# EAGLE schematic testESP ver.1 (EAGLE 9.6.2)
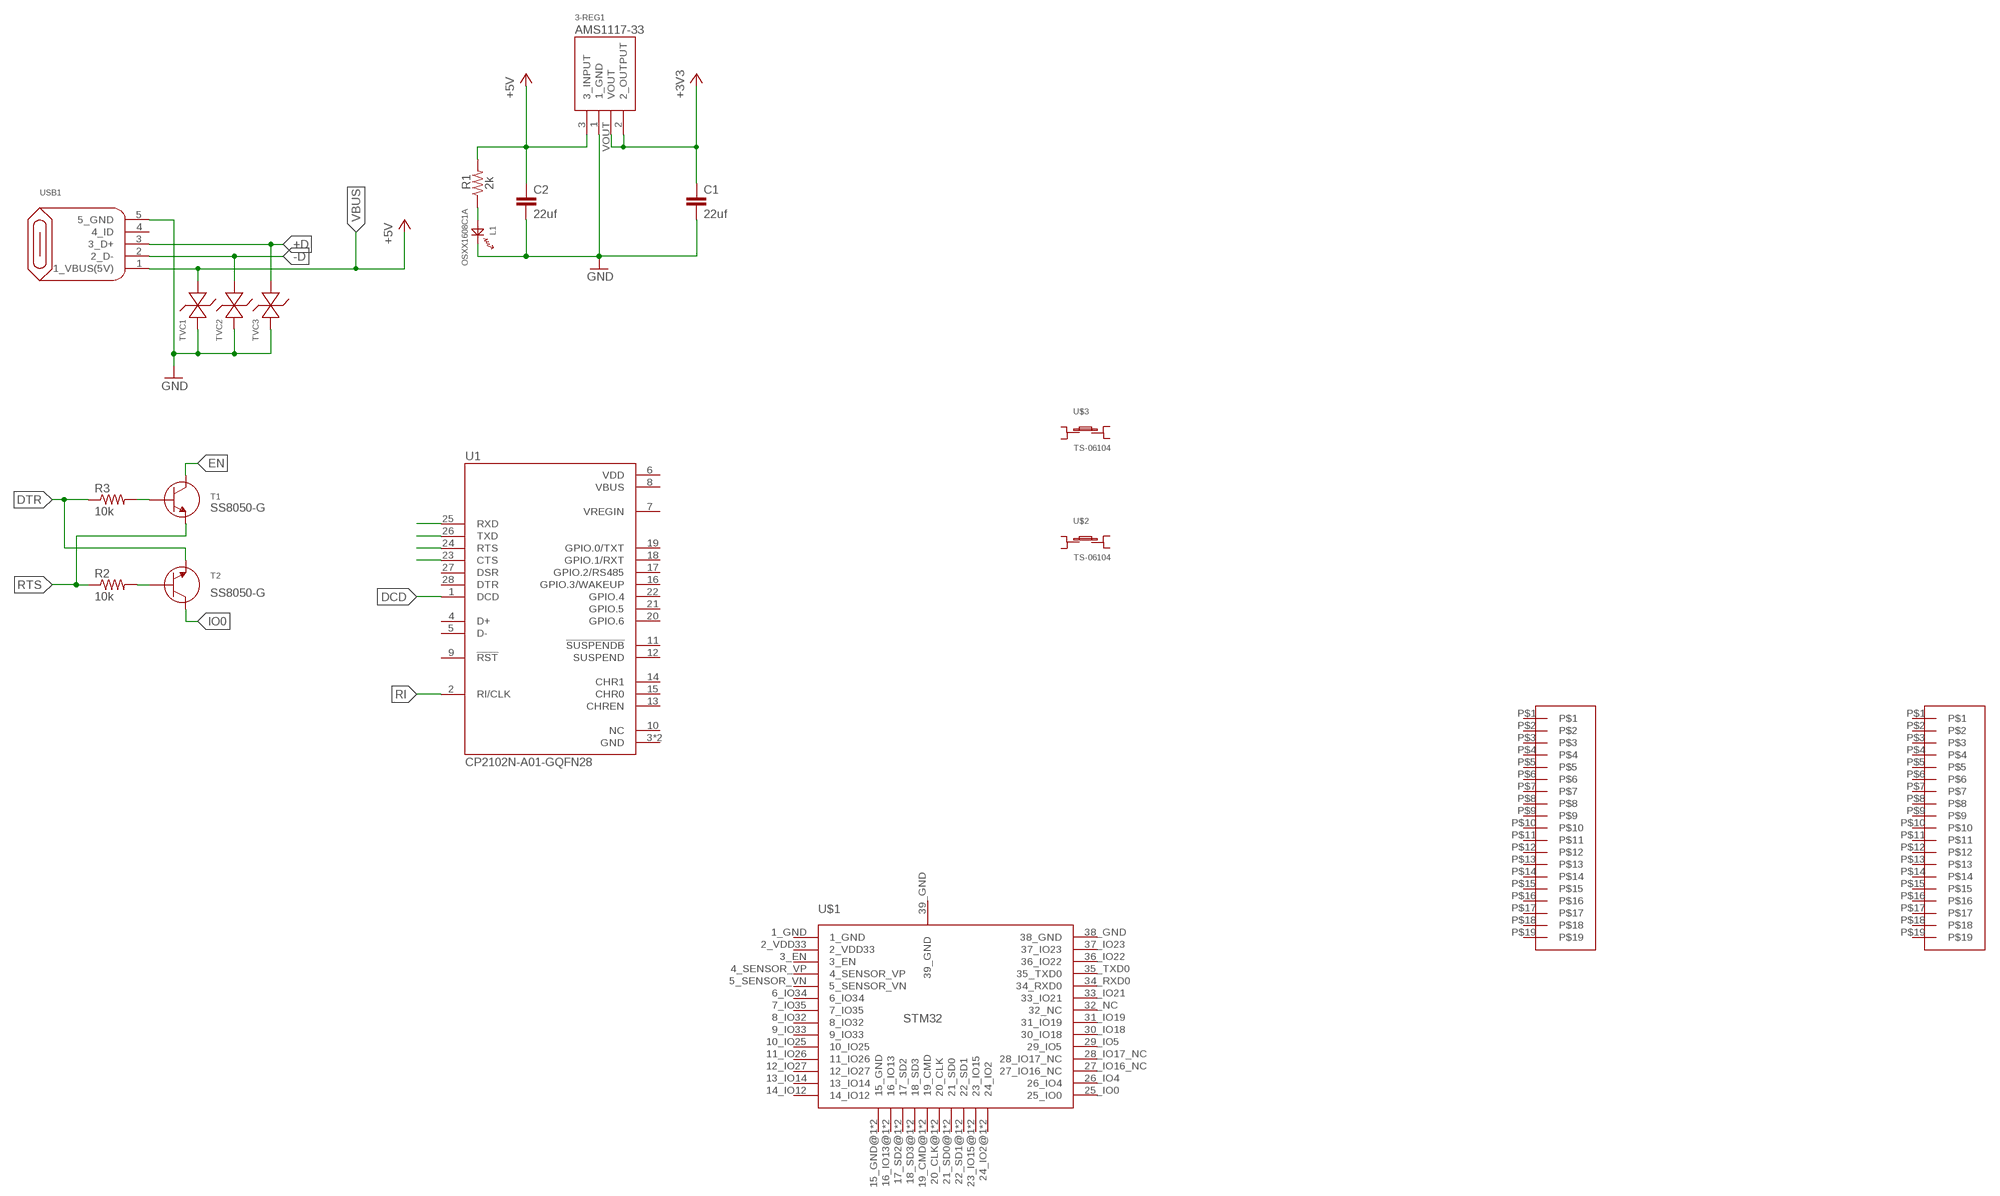
[diagram p0: schematic, sheet 1]

## Parts
3-REG1  AZ1117CH-3.3TRG1  [AZ1117CH-3.3TRG1]
C1  22uf  C-EUC0603  [C0603]
C2  22uf  C-EUC0603  [C0603]
L1  OSXX1608C1A  [OSXX1608C1A]
R1  2k  R-US_R0201  [R0201]
R2  10k  R-US_R0201  [R0201]
R3  10k  R-US_R0201  [R0201]
T1  NPN_SS8050-G  [NPN_SS8050-G]
T2  NPN_SS8050-G  [NPN_SS8050-G]
TVC1  ESD5484FCT5G  [ESD5484FCT5G]
TVC2  ESD5484FCT5G  [ESD5484FCT5G]
TVC3  ESD5484FCT5G  [ESD5484FCT5G]
U1  CP2102N-A01-GQFN28  [QFN50P500X500X80-29N]
U$1  ESP32-WROOM&WROVER  [ESP32-WROVER&WROOM]
U$2  TS-06104  [TS-06104]
U$3  TS-06104  [TS-06104]
U$4  19_2.54  [19_2.54]
U$5  19_2.54  [19_2.54]
USB1  MICRO-B_ZX62R-B-5P  [MICRO-B_ZX62R-B-5P]

## Nets
+3V3: 3-REG1.2(2_OUTPUT) 3-REG1.VOUT C1.1
+5V: 3-REG1.3(3_INPUT) C2.1 R1.2
+D: TVC3.2_AN USB1.3(3_D+)
-D: TVC2.2_AN USB1.2(2_D-)
DCD: U1.1(DCD)
DTR: R3.1 T2.2
EN: T1.3
GND: 3-REG1.1(1_GND) C1.2 C2.2 L1.CT TVC1.1_CT TVC2.1_CT TVC3.1_CT USB1.5(5_GND)
IO0: T2.3
N$1: L1.AN R1.1
N$2: R3.2 T1.1
N$3: U1.25(RXD)
N$4: U1.26(TXD)
N$5: R2.2 T2.1
N$6: U1.24(RTS)
N$7: U1.23(CTS)
RI: U1.2(RI/CLK)
RTS: R2.1 T1.2
VBUS: TVC1.2_AN USB1.1(1_VBUS(5V)) ; supply symbol labelled +5V
Unconnected: U1.4(D+) U1.5(D-) U1.9(!RST) U1.10(NC) U1.11(!SUSPENDB) U1.12(SUSPEND) U1.13(CHREN) U1.14(CHR1) U1.15(CHR0) U1.16(GPIO.3/WAKEUP) U1.17(GPIO.2/RS485) U1.18(GPIO.1/RXT) U1.19(GPIO.0/TXT) U1.20(GPIO.6) U1.21(GPIO.5) U1.22(GPIO.4) U1.27(DSR) U1.28(DTR) U$1.1_GND U$1.2_VDD33 U$1.3_EN U$1.4_SENSOR_VP U$1.5_SENSOR_VN U$1.6_IO34 U$1.7_IO35 U$1.8_IO32 U$1.9_IO33 U$1.10_IO25 U$1.11_IO26 U$1.12_IO27 U$1.13_IO14 U$1.14_IO12 U$1.15_GND@1(15_GND) U$1.15_GND@2(15_GND) U$1.16_IO13@1(16_IO13) U$1.16_IO13@2(16_IO13) U$1.17_SD2@1(17_SD2) U$1.17_SD2@2(17_SD2) U$1.18_SD3@1(18_SD3) U$1.18_SD3@2(18_SD3) U$1.19_CMD@1(19_CMD) U$1.19_CMD@2(19_CMD) U$1.20_CLK@1(20_CLK) U$1.20_CLK@2(20_CLK) U$1.21_SD0@1(21_SD0) U$1.21_SD0@2(21_SD0) U$1.22_SD1@1(22_SD1) U$1.22_SD1@2(22_SD1) U$1.23_IO15@1(23_IO15) U$1.23_IO15@2(23_IO15) U$1.24_IO2@1(24_IO2) U$1.24_IO2@2(24_IO2) U$1.25_IO0 U$1.26_IO4 U$1.27_IO16_NC U$1.28_IO17_NC U$1.29_IO5 U$1.30_IO18 U$1.31_IO19 U$1.32_NC U$1.33_IO21 U$1.34_RXD0 U$1.35_TXD0 U$1.36_IO22 U$1.37_IO23 U$1.38_GND U$1.39_GND U$2.A U$2.B U$2.C U$2.D U$3.A U$3.B U$3.C U$3.D U$4.P$1 U$4.P$2 U$4.P$3 U$4.P$4 U$4.P$5 U$4.P$6 U$4.P$7 U$4.P$8 U$4.P$9 U$4.P$10 U$4.P$11 U$4.P$12 U$4.P$13 U$4.P$14 U$4.P$15 U$4.P$16 U$4.P$17 U$4.P$18 U$4.P$19 U$5.P$1 U$5.P$2 U$5.P$3 U$5.P$4 U$5.P$5 U$5.P$6 U$5.P$7 U$5.P$8 U$5.P$9 U$5.P$10 U$5.P$11 U$5.P$12 U$5.P$13 U$5.P$14 U$5.P$15 U$5.P$16 U$5.P$17 U$5.P$18 U$5.P$19 USB1.4(4_ID)

## Notes on the sheet
- SS8050-G
- SS8050-G

## Power pins joined to a net without a drawn wire
GND: U1.3(GND) U1.29(GND)
VBUS: U1.8(VBUS)
VDD: U1.6(VDD)
VREGIN: U1.7(VREGIN)

## Library data of the parts
3-REG1 = Chip 3-Terminal Regulator:AZ1117CH-3.3TRG1
C1 C2 = rcl:C-EU: CAPACITOR, European symbol; SPICEPREFIX: C
L1 = ChipLED:OSXX1608C1A
R1-R3 = rcl:R-US_: RESISTOR, American symbol; SPICEPREFIX: R
T1 T2 = ChipTransister:NPN_SS8050-G
TVC1-TVC3 = TVC Diode:ESD5484FCT5G
U1 = CP2102N-A01-GQFN28:CP2102N-A01-GQFN28: USB Bridge, USB to UART USB 2.0 UART Interface 28-QFN (5x5) Check availability <https://pricing.snapeda.com/parts/CP2102N-A01-GQFN28/Silicon%20Labs/view-part?ref=eda>; AVAILABILITY: In Stock; DESCRIPTION: USB Bridge, USB to UART USB 2.0 UART Interface 28-QFN (5x5); MF: Silicon Labs; MP: CP2102N-A01-GQFN28; PACKAGE: QFN-28 Silicon Labs; PRICE: None; PURCHASE-URL: https://pricing.snapeda.com/search/part/CP2102N-A01-GQFN28/?ref=eda
U$1 = ESP32:ESP32-WROOM&WROVER
U$2 U$3 = Switches:TS-06104
U$4 U$5 = JumperPins:19_2.54
USB1 = USB:MICRO-B_ZX62R-B-5P